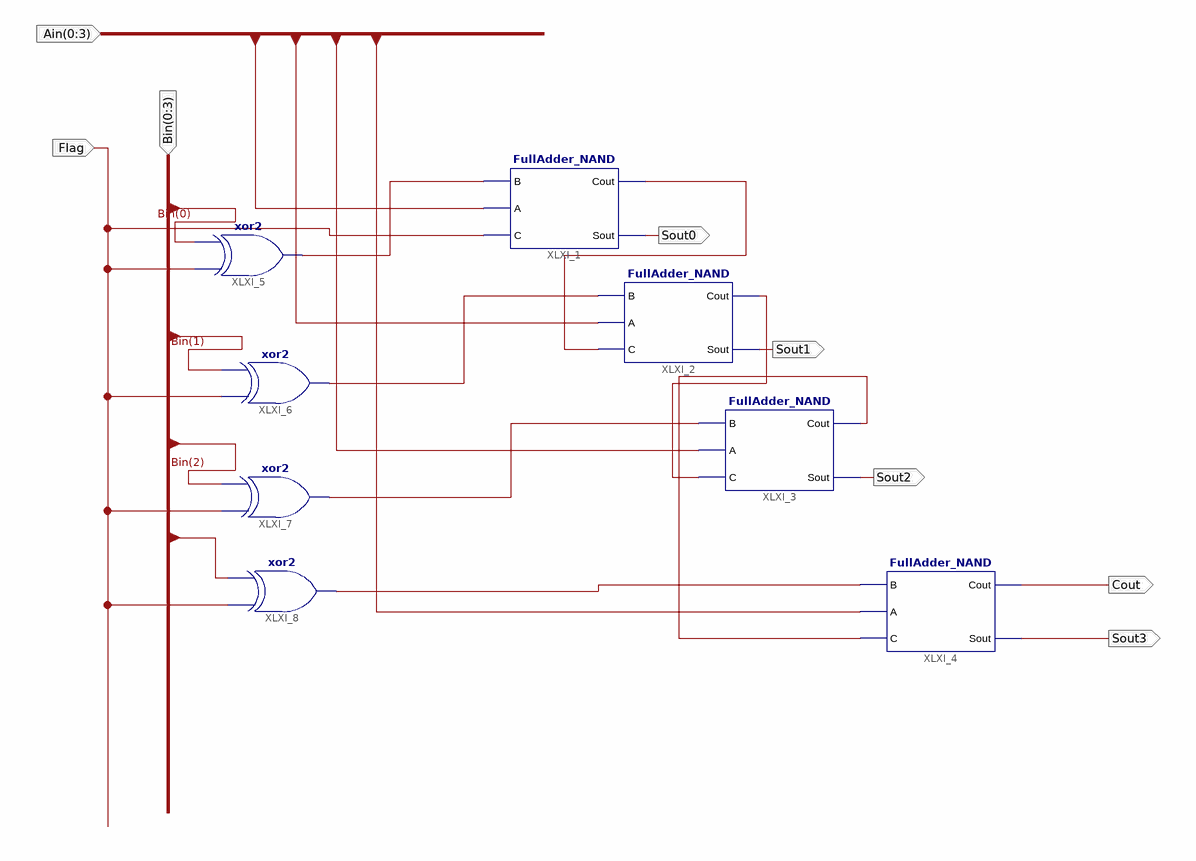
[diagram p0: schematic sheet 1]
// Xilinx ISE schematic Subtractor.sch (spartan3e) as structural Verilog: 8 symbols, 8 ports
module Subtractor (
  input  [0:3] Ain,
  input  Flag,
  input  [0:3] Bin,
  output Sout0,
  output Sout1,
  output Sout2,
  output Sout3,
  output Cout
);

  wire XLXN_9, XLXN_10, XLXN_11, XLXN_33, XLXN_34, XLXN_38, XLXN_40;

  FullAdder_NAND XLXI_1 (.B(XLXN_38), .A(Ain[0]), .C(Flag), .Cout(XLXN_9), .Sout(Sout0));
  FullAdder_NAND XLXI_2 (.B(XLXN_40), .A(Ain[1]), .C(XLXN_9), .Cout(XLXN_10), .Sout(Sout1));
  FullAdder_NAND XLXI_3 (.B(XLXN_33), .A(Ain[2]), .C(XLXN_10), .Cout(XLXN_11), .Sout(Sout2));
  FullAdder_NAND XLXI_4 (.B(XLXN_34), .A(Ain[3]), .C(XLXN_11), .Cout(Cout), .Sout(Sout3));
  xor XLXI_5 (XLXN_38, Flag, Bin[0]);
  xor XLXI_6 (XLXN_40, Flag, Bin[1]);
  xor XLXI_7 (XLXN_33, Flag, Bin[2]);
  xor XLXI_8 (XLXN_34, Flag, Bin[3]);
endmodule
